# Altium schematic sheet GPM8F3496A.SchDoc
size A2
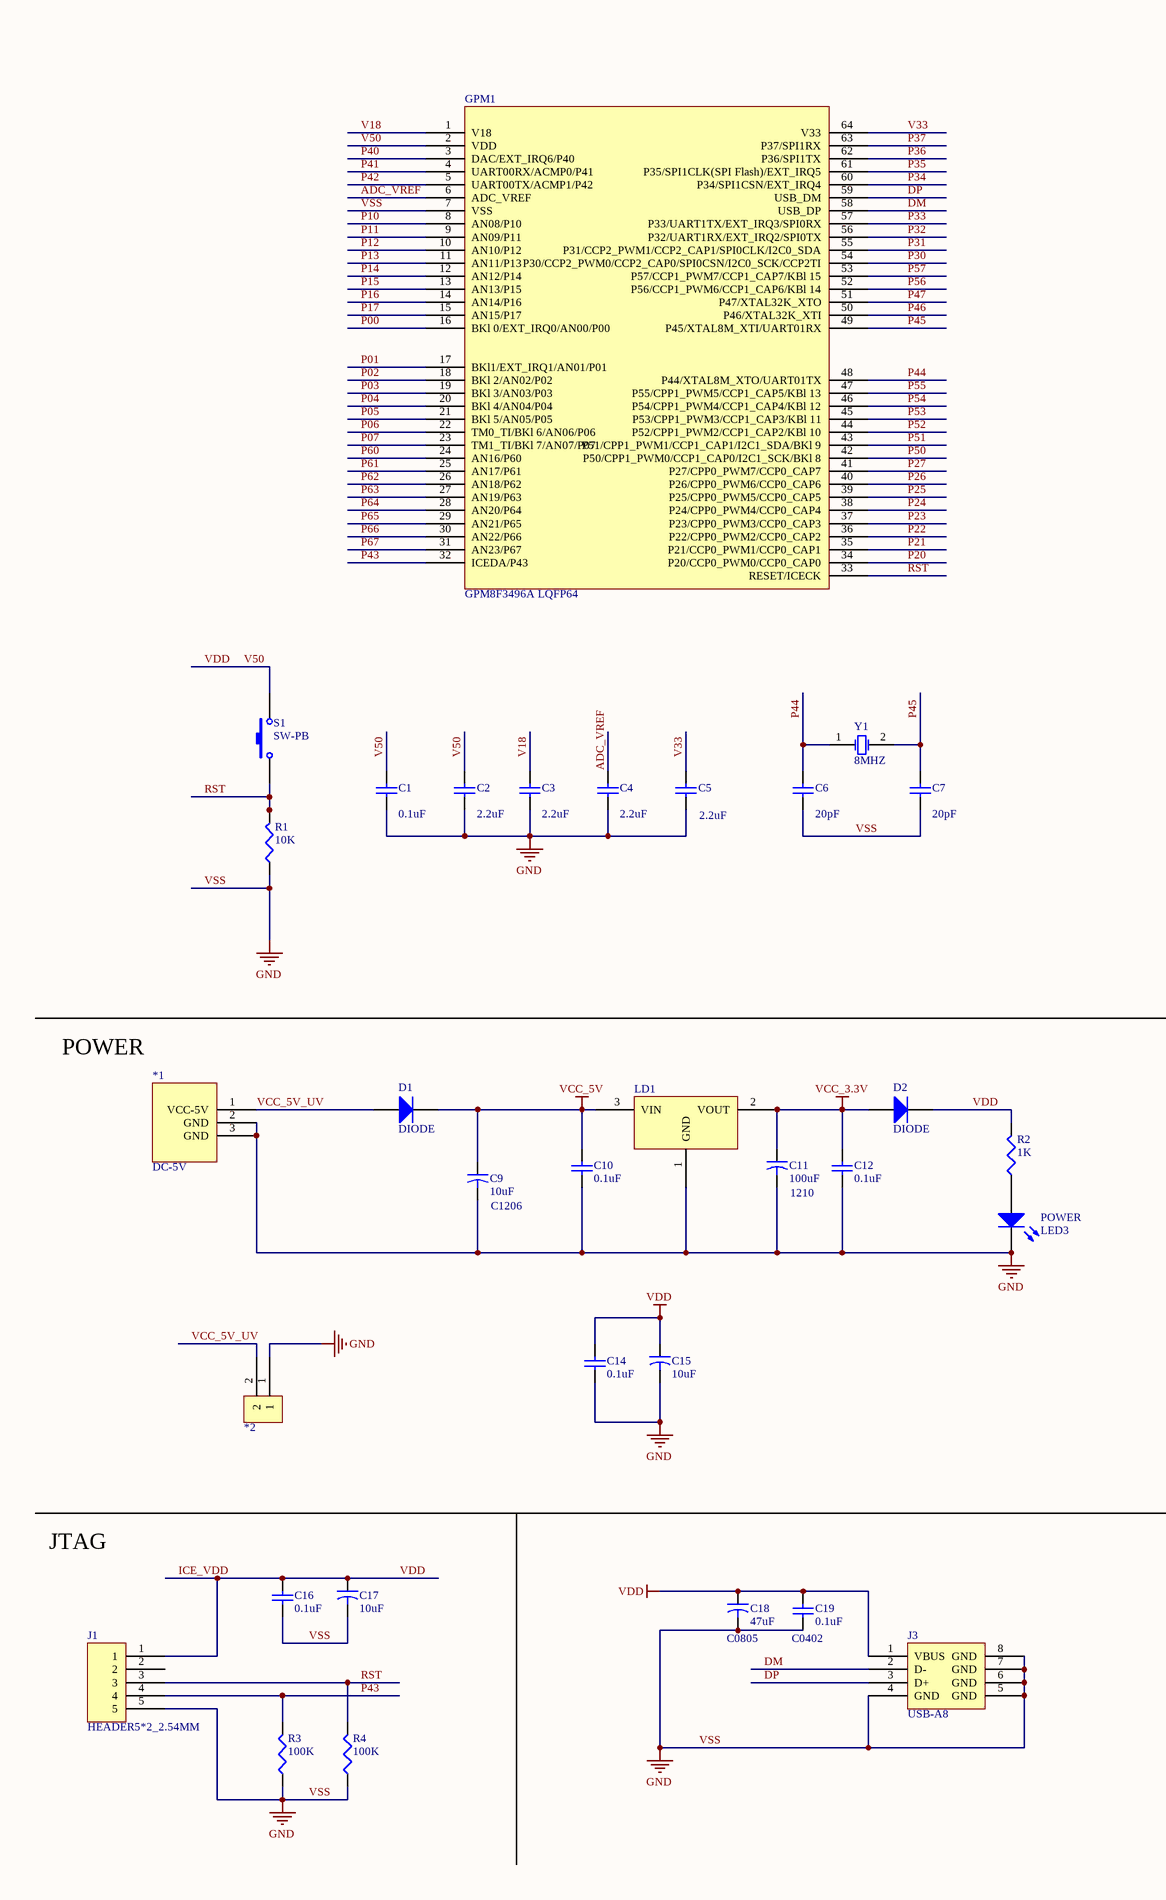
[diagram p0: GPM8F3496A.SchDoc, left]
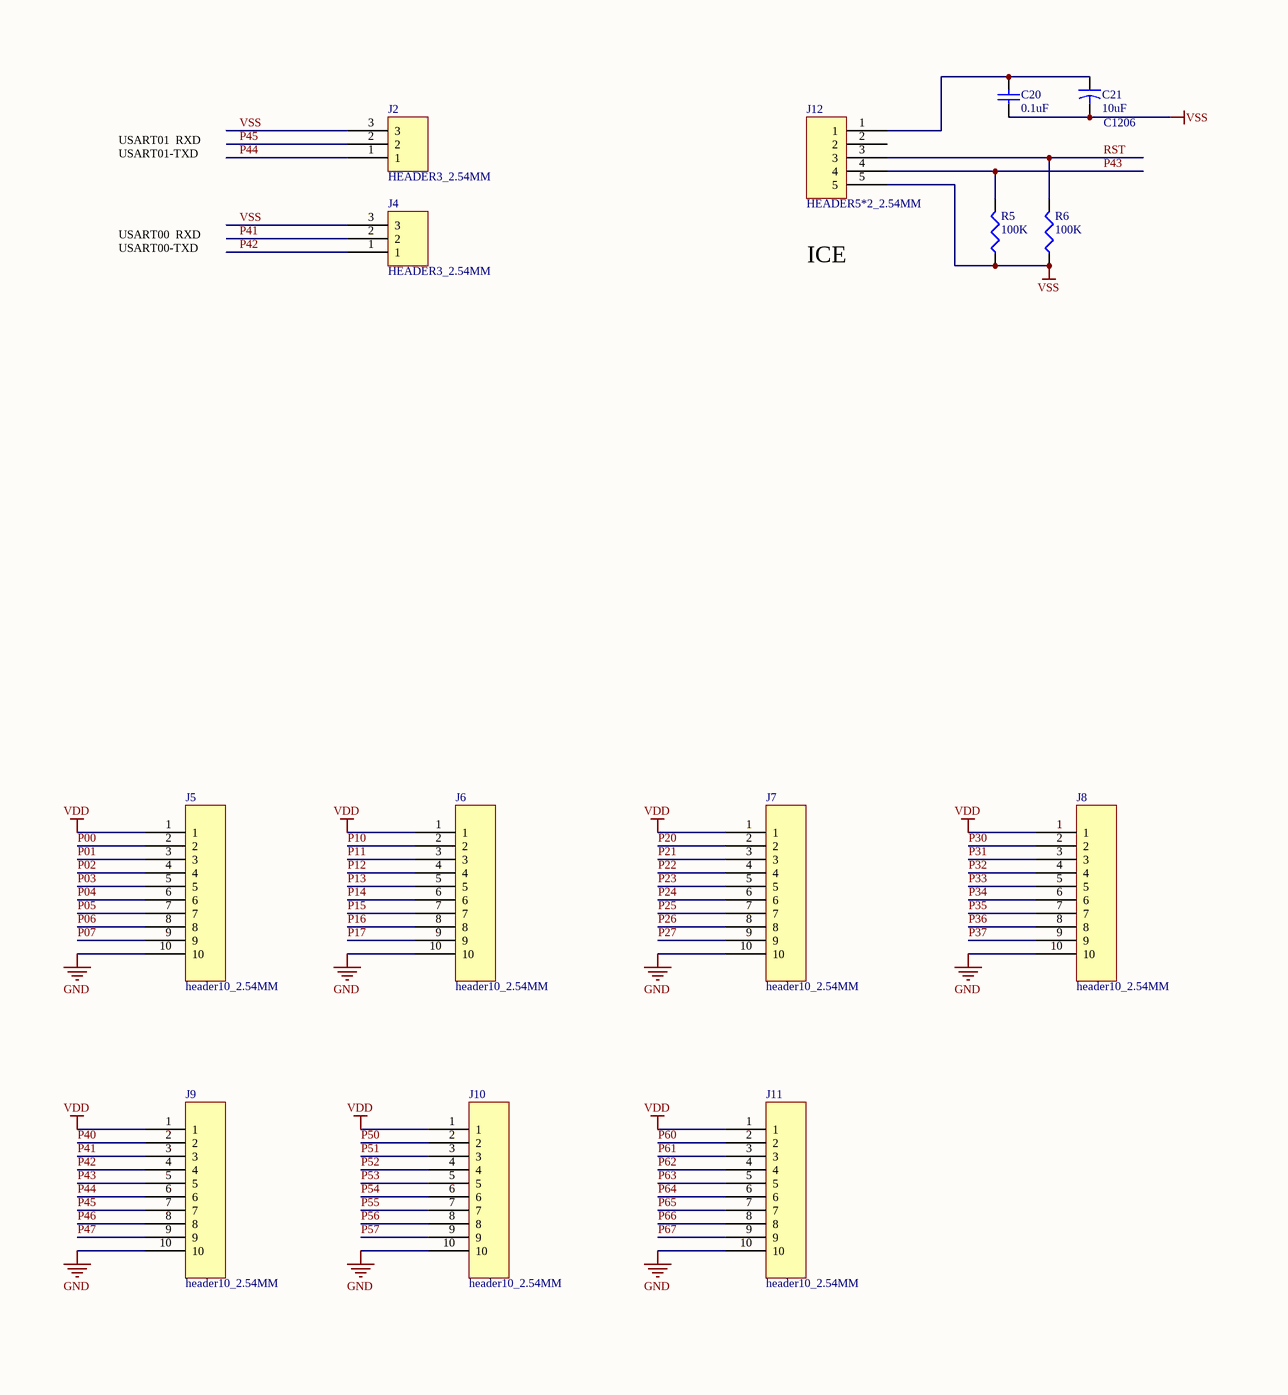
[diagram p1: GPM8F3496A.SchDoc, right]

## Parts
*1  DC-5V  [DC-5V]
*2  2PIN_PITCH_2.54MM  [2PIN_PITCH_2.54MM]  (value not drawn)
C1  value 0.1uF  [C0402]  (hidden comment: Cap)
C2  value 2.2uF  [C0402]  (hidden comment: Cap)
C3  value 2.2uF  [C0402]  (hidden comment: Cap)
C4  value 2.2uF  [C0402]  (hidden comment: Cap)
C5  2.2uF  [C0402]
C6  value 20pF  [C0402]  (hidden comment: Cap)
C7  value 20pF  [C0402]  (hidden comment: Cap)
C9  10uF  [C1206]
C10  0.1uF  [C0402]
C11  100uF  [1210]
C12  0.1uF  [C0402]
C14  0.1uF  [C0402]
C15  10uF  [C1206]
C16  0.1uF  [C0402]
C17  10uF  [C1206]
C18  47uF  [C0805]
C19  0.1uF  [C0402]
C20  0.1uF  [C0402]
C21  10uF  [C1206]
D1  DIODE  [R1206]
D2  DIODE  [R1206]
GPM1  GPM8F3496A LQFP64  [GPM8F3496A LQFP64]
J1  HEADER5*2_2.54MM  [HEADER5_2.54MM]
J2  HEADER3_2.54MM  [HEADER3_2.54MM]
J3  USB-A8  [USB-A8]
J4  HEADER3_2.54MM  [HEADER3_2.54MM]
J5  header10_2.54MM  [HEADER10_2.54MM]
J6  header10_2.54MM  [HEADER10_2.54MM]
J7  header10_2.54MM  [HEADER10_2.54MM]
J8  header10_2.54MM  [HEADER10_2.54MM]
J9  header10_2.54MM  [HEADER10_2.54MM]
J10  header10_2.54MM  [HEADER10_2.54MM]
J11  header10_2.54MM  [HEADER10_2.54MM]
J12  HEADER5*2_2.54MM  [HEADER5_2.54MM]
LD1  SOT-223  [LD1117S33TR]  (value not drawn)
POWER  LED3  [LED_0603]
R1  10K  [R0603]
R2  1K  [R0603]
R3  100K  [R0603]
R4  100K  [R0603]
R5  100K  [R0603]
R6  100K  [R0603]
S1  SW-PB  [SWSW-2P-6.5M]
Y1  8MHZ  [XTAL8M]

## Nets
ICE_VDD: C1.2 C2.2 C14.2 C15.1 C16.2 C17.1 C18.1 C19.2 D2.2(K) GPM1.2(VDD) J1.1 J3.1(VBUS) J5.1 J6.1 J7.1 J8.1 J9.1 J10.1 J11.1 R2.2 S1.2  [also labelled V50, VDD]
VCC_3.3V: C11.1 C12.2 D2.1(A) LD1.2(VOUT)
VCC_5V: C9.1 C10.2 D1.2(K) LD1.3(VIN)
VSS: *1.2(GND) *1.3(GND) *2.1 C1.1 C2.1 C3.1 C4.1 C5.1 C6.1 C7.1 C9.2 C10.1 C11.2 C12.1 C14.1 C15.2 C16.1 C17.2 C18.2 C19.1 C20.1 C21.2 GPM1.7(VSS) J1.5 J2.3 J3.4(GND) J3.5(GND) J3.6(GND) J3.7(GND) J3.8(GND) J4.3 J5.10 J6.10 J7.10 J8.10 J9.10 J10.10 J11.10 J12.5 LD1.1(GND) POWER.2(K) R1.1 R3.1 R4.1 R5.1 R6.1  [also labelled GND]
ADC_VREF: C4.2 GPM1.6(ADC_VREF)
DM: GPM1.58(USB_DP) J3.2(D-)
DP: GPM1.59(USB_DM) J3.3(D+)
P00: GPM1.16(BKl_0/EXT_IRQ0/AN00/P00) J5.2
P01: GPM1.17(BKl1/EXT_IRQ1/AN01/P01) J5.3
P02: GPM1.18(BKl_2/AN02/P02) J5.4
P03: GPM1.19(BKl_3/AN03/P03) J5.5
P04: GPM1.20(BKl_4/AN04/P04) J5.6
P05: GPM1.21(BKl_5/AN05/P05) J5.7
P06: GPM1.22(TM0_TI/BKl_6/AN06/P06) J5.8
P07: GPM1.23(TM1_TI/BKl_7/AN07/P07) J5.9
P10: GPM1.8(AN08/P10) J6.2
P11: GPM1.9(AN09/P11) J6.3
P12: GPM1.10(AN10/P12) J6.4
P13: GPM1.11(AN11/P13) J6.5
P14: GPM1.12(AN12/P14) J6.6
P15: GPM1.13(AN13/P15) J6.7
P16: GPM1.14(AN14/P16) J6.8
P17: GPM1.15(AN15/P17) J6.9
P20: GPM1.34(P20/CCP0_PWM0/CCP0_CAP0) J7.2
P21: GPM1.35(P21/CCP0_PWM1/CCP0_CAP1) J7.3
P22: GPM1.36(P22/CPP0_PWM2/CCP0_CAP2) J7.4
P23: GPM1.37(P23/CPP0_PWM3/CCP0_CAP3) J7.5
P24: GPM1.38(P24/CPP0_PWM4/CCP0_CAP4) J7.6
P25: GPM1.39(P25/CPP0_PWM5/CCP0_CAP5) J7.7
P26: GPM1.40(P26/CPP0_PWM6/CCP0_CAP6) J7.8
P27: GPM1.41(P27/CPP0_PWM7/CCP0_CAP7) J7.9
P30: GPM1.54(P30/CCP2_PWM0/CCP2_CAP0/SPI0CSN/I2C0_SCK/CCP2TI) J8.2
P31: GPM1.55(P31/CCP2_PWM1/CCP2_CAP1/SPI0CLK/I2C0_SDA) J8.3
P32: GPM1.56(P32/UART1RX/EXT_IRQ2/SPI0TX) J8.4
P33: GPM1.57(P33/UART1TX/EXT_IRQ3/SPI0RX) J8.5
P34: GPM1.60(P34/SPI1CSN/EXT_IRQ4) J8.6
P35: GPM1.61(P35/SPI1CLK(SPI_Flash)/EXT_IRQ5) J8.7
P36: GPM1.62(P36/SPI1TX) J8.8
P37: GPM1.63(P37/SPI1RX) J8.9
P40: GPM1.3(DAC/EXT_IRQ6/P40) J9.2
P41: GPM1.4(UART00RX/ACMP0/P41) J4.2 J9.3
P42: GPM1.5(UART00TX/ACMP1/P42) J4.1 J9.4
P43: GPM1.32(ICEDA/P43) J1.4 J9.5 J12.4 R3.2 R5.2
P44: C6.2 GPM1.48(P44/XTAL8M_XTO/UART01TX) J2.1 J9.6 Y1.1(OSC1)
P45: C7.2 GPM1.49(P45/XTAL8M_XTI/UART01RX) J2.2 J9.7 Y1.2(OSC2)
P46: GPM1.50(P46/XTAL32K_XTI) J9.8
P47: GPM1.51(P47/XTAL32K_XTO) J9.9
P50: GPM1.42(P50/CPP1_PWM0/CCP1_CAP0/I2C1_SCK/BKl_8) J10.2
P51: GPM1.43(P51/CPP1_PWM1/CCP1_CAP1/I2C1_SDA/BKl_9) J10.3
P52: GPM1.44(P52/CPP1_PWM2/CCP1_CAP2/KBl_10) J10.4
P53: GPM1.45(P53/CPP1_PWM3/CCP1_CAP3/KBl_11) J10.5
P54: GPM1.46(P54/CPP1_PWM4/CCP1_CAP4/KBl_12) J10.6
P55: GPM1.47(P55/CPP1_PWM5/CCP1_CAP5/KBl_13) J10.7
P56: GPM1.52(P56/CCP1_PWM6/CCP1_CAP6/KBl_14) J10.8
P57: GPM1.53(P57/CCP1_PWM7/CCP1_CAP7/KBl_15) J10.9
P60: GPM1.24(AN16/P60) J11.2
P61: GPM1.25(AN17/P61) J11.3
P62: GPM1.26(AN18/P62) J11.4
P63: GPM1.27(AN19/P63) J11.5
P64: GPM1.28(AN20/P64) J11.6
P65: GPM1.29(AN21/P65) J11.7
P66: GPM1.30(AN22/P66) J11.8
P67: GPM1.31(AN23/P67) J11.9
RST: GPM1.33(RESET/ICECK) J1.3 J12.3 R1.2 R4.2 R6.2 S1.1
V18: C3.2 GPM1.1(V18)
V33: C5.2 GPM1.64(V33)
VCC_5V_UV: *1.1(VCC-5V) *2.2 D1.1(A)
NetC20_2: C20.2 C21.1 J12.1
NetPOWER_1: POWER.1(A) R2.1

Not connected (* = marked no-connect by the designer): J1 2; J12 2

## Notes on the sheet
- USART01_RXD
- USART01-TXD
- SDA
- USART00_RXD
- USART00-TXD
- ICE
- POWER
- JTAG

## Library data of the parts
C1-C7 C12 = Cap: Capacitor; Published: 8-Jun-2000; LatestRevisionDate: 17-Jul-2002; LatestRevisionNote: Re-released for DXP Platform.; PackageReference: RAD-0.3; Publisher: Altium Limited
C9 C11 C15 C17 C18 C21 = Cap2: Capacitor; Published: 23-Sep-2002; PackageReference: CAPR5-4X5; Publisher: Altium Limited
C10 C14 C16 C19 C20 = Cap: Capacitor; Value: 10uF; Published: 8-Jun-2000; LatestRevisionDate: 17-Jul-2002; LatestRevisionNote: Re-released for DXP Platform.; PackageReference: RAD-0.3; Publisher: Altium Limited
D1 = Diode 1N4149: Computer Diode; Published: 8-Jun-2000; LatestRevisionDate: 17-Jul-2002; LatestRevisionNote: Re-released for DXP Platform.; DatasheetVersion: 1989; PackageVersion: 1989; PackageReference: DO-35A; Publisher: Altium Limited; Code_JEDEC: DO-204-AH; ComponentLink1Description: Manufacturer Link; ComponentLink1URL: http://www.national.com/
D2 = Diode 1N914: High Conductance Fast Diode; Published: 8-Jun-2000; LatestRevisionDate: 17-Jul-2002; LatestRevisionNote: Re-released for DXP Platform.; DatasheetVersion: 1997; PackageReference: DO-35; Publisher: Altium Limited; Code_JEDEC: DO-204-AH; ComponentLink1Description: Manufacturer Link; ComponentLink1URL: http://www.fairchildsemi.com/; ComponentLink2Description: Datasheet; ComponentLink2URL: http://www.fairchildsemi.com/ds/1N%2F1N4448.pdf
LD1 = LD1117S33TR
POWER = LED3: Typical BLUE SiC LED; Published: 8-Jun-2000; LatestRevisionDate: 17-Dec-2003; LatestRevisionNote: PCB Footprint replaced.; DatasheetVersion: 16-Apr-2002; PackageVersion: 16-Apr-2002; PackageReference: 3.5X2.8X1.9; Publisher: Altium Limited
R1-R6 = Res3: Resistor; Published: 8-Jun-2000; LatestRevisionDate: 29-May-2009; LatestRevisionNote: IPC-7351 Footprint Added.; PackageReference: J1-0603; Publisher: Altium Limited; PackageDescription: Chip Resistor
S1 = SW-PB: Switch; Published: 24-Mar-1999; LatestRevisionDate: 17-Jul-2002; LatestRevisionNote: Re-released for DXP Platform.; PackageReference: SPST-2; Publisher: Altium Limited
Y1 = XTAL: Crystal Oscillator; Published: 8-Jun-2000; LatestRevisionDate: 17-Jul-2002; LatestRevisionNote: Re-released for DXP Platform.; PackageReference: R38; Publisher: Altium Limited